# Altium schematic sheet device-ground-box.SchDoc
size 297 x 209 mm
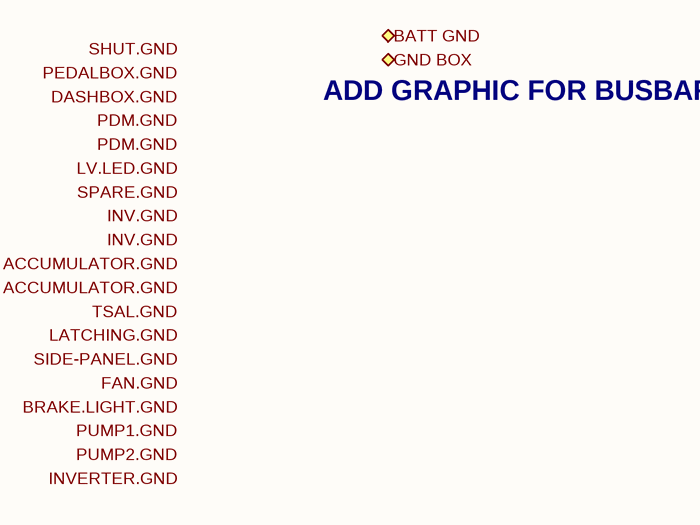
[diagram p0: device-ground-box.SchDoc]

## Ports
BATT GND (bidir), GND BOX (bidir)

## Notes on the sheet
- ADD GRAPHIC FOR BUSBAR
- Labels drawn without touching a wire or pin: ACCUMULATOR.GND, BRAKE.LIGHT.GND, DASHBOX.GND, FAN.GND, INV.GND, INVERTER.GND, LATCHING.GND, LV.LED.GND, PDM.GND, PEDALBOX.GND, PUMP1.GND, PUMP2.GND, SHUT.GND, SIDE-PANEL.GND, SPARE.GND, TSAL.GND
- 1
- 2
- 3
- 4
- 5
- 6
- A
- B
- C
- D
- Title: DEVICE - GROUND BOX
- File: device-ground-box.kicad_sch
- Sheet: /
- KiCad E.D.A.  kicad (5.1.4)-1
- Size: A4
- Date:
- Rev:
- Id: 1/1